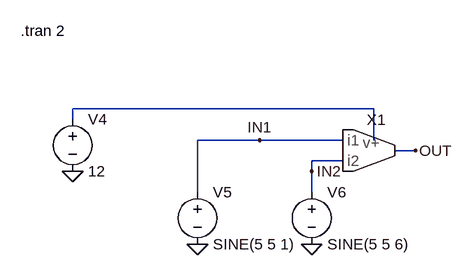
[diagram p0: schematic _Comparator.asc]
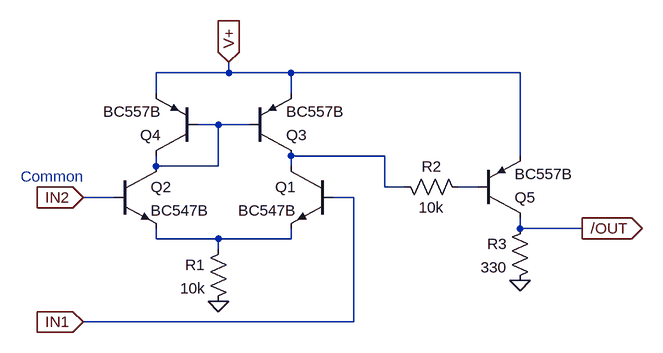
[diagram p1: sub-circuit comparator.asc]
_Comparator.asc, the LTspice schematic file:
Version 4
SHEET 1 880 680
WIRE -688 112 -1152 112
WIRE -1152 128 -1152 112
WIRE -864 160 -960 160
WIRE -736 160 -864 160
WIRE -688 160 -688 112
WIRE -624 176 -656 176
WIRE -736 192 -784 192
WIRE -784 208 -784 192
WIRE -960 240 -960 160
WIRE -784 240 -784 208
FLAG -960 320 0
FLAG -784 320 0
FLAG -1152 208 0
FLAG -624 176 OUT
FLAG -864 160 IN1
FLAG -784 208 IN2
SYMBOL voltage -1152 112 R0
SYMATTR InstName V4
SYMATTR Value 12
SYMBOL voltage -960 224 R0
SYMATTR InstName V5
SYMATTR Value SINE(5 5 1)
SYMBOL voltage -784 224 R0
SYMATTR InstName V6
SYMATTR Value SINE(5 5 6)
SYMBOL Comparator -656 176 R0
SYMATTR InstName X1
TEXT -1232 -8 Left 2 !.tran 2

comparator.asc, the sub-circuit schematic file:
Version 4
SHEET 1 1272 680
WIRE -32 -16 -32 -32
WIRE -32 -16 -144 -16
WIRE 64 -16 -32 -16
WIRE 416 -16 64 -16
WIRE -144 16 -144 -16
WIRE 64 16 64 -16
WIRE -48 64 -80 64
WIRE 0 64 -48 64
WIRE 208 112 64 112
WIRE 416 112 416 -16
WIRE -144 128 -144 112
WIRE -48 128 -48 64
WIRE -48 128 -144 128
WIRE 64 128 64 112
WIRE 208 160 208 112
WIRE 240 160 208 160
WIRE 352 160 320 160
WIRE -208 176 -256 176
WIRE 160 176 128 176
WIRE 416 224 416 208
WIRE 512 224 416 224
WIRE -144 240 -144 224
WIRE -48 240 -144 240
WIRE 64 240 64 224
WIRE 64 240 -48 240
WIRE -48 256 -48 240
WIRE 160 368 160 176
WIRE 160 368 -256 368
FLAG -48 336 0
FLAG 416 304 0
FLAG 512 224 /OUT
IOPIN 512 224 Out
FLAG -32 -32 V+
IOPIN -32 -32 In
FLAG -256 176 IN2
IOPIN -256 176 In
FLAG -256 368 IN1
IOPIN -256 368 In
SYMBOL npn 128 128 M0
SYMATTR InstName Q1
SYMATTR Value BC547B
SYMBOL pnp -80 112 R180
SYMATTR InstName Q4
SYMATTR Value BC557B
SYMBOL res -32 240 M0
SYMATTR InstName R1
SYMATTR Value 10k
SYMBOL npn -208 128 R0
SYMATTR InstName Q2
SYMATTR Value BC547B
SYMBOL res 432 208 M0
SYMATTR InstName R3
SYMATTR Value 330
SYMBOL res 224 144 M90
WINDOW 0 0 56 VBottom 2
WINDOW 3 32 56 VTop 2
SYMATTR InstName R2
SYMATTR Value 10k
SYMBOL pnp 0 112 M180
SYMATTR InstName Q3
SYMATTR Value BC557B
SYMBOL pnp 352 208 M180
SYMATTR InstName Q5
SYMATTR Value BC557B
TEXT -352 144 Left 2 ;Common

The netlist it stands for:
* _Comparator.asc
V4 N001 0 12
V5 IN1 0 SINE(5 5 1)
V6 IN2 0 SINE(5 5 6)
XX1 IN1 IN2 N001 OUT comparator

* block symbol definitions
.subckt comparator IN1 IN2 V+ /OUT
Q1 N002 IN1 N004 0 BC547B
Q4 N001 N001 V+ 0 BC557B
R1 N004 0 10k
Q2 N001 IN2 N004 0 BC547B
R3 /OUT 0 330
R2 N002 N003 10k
Q3 N002 N001 V+ 0 BC557B
Q5 /OUT N003 V+ 0 BC557B
* Common
.ends comparator

.model NPN NPN
.model PNP PNP
.lib standard.bjt
.tran 2
.backanno
.end